# Altium schematic sheet FPGA PCIe.SchDoc: FPGA PCIe
size A4; Organization: Blinkinlabs, LLC; DocumentNumber: 10; SheetNumber: 11; SheetTotal: 14
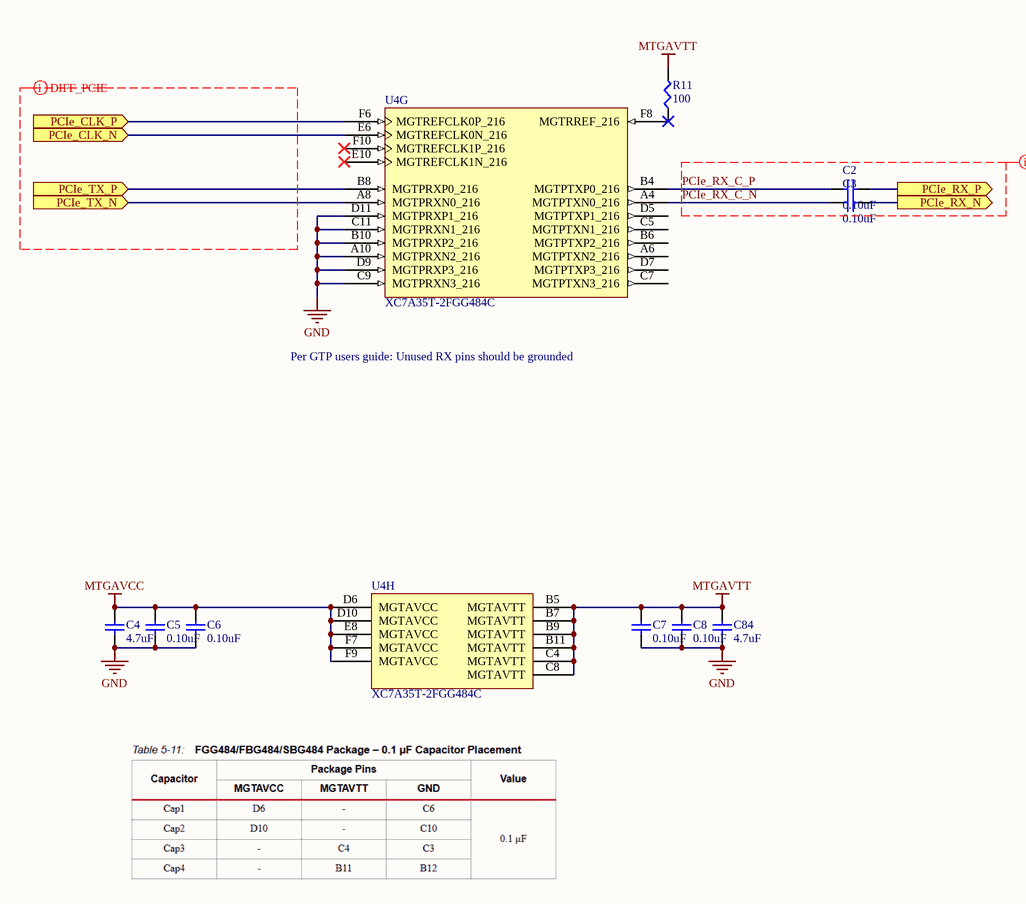
[diagram p0: FPGA PCIe.SchDoc]

## Parts
C2  0.10uF  [CAPC0603X03L]
C3  0.10uF  [CAPC0603X03L]
C4  4.7uF  [CAPC1005X06L]
C5  0.10uF  [CAPC0603X03L]
C6  0.10uF  [CAPC0603X03L]
C7  0.10uF  [CAPC0603X03L]
C8  0.10uF  [CAPC0603X03L]
C84  4.7uF  [CAPC1005X06L]
R11  100  [ERJ2G(0402)_L]
U4  XC7A35T-2FGG484C  [FGG484]  (parts G,H of 12)

## Ports
PCIe_CLK_N (in), PCIe_CLK_P (in), PCIe_RX_N (out), PCIe_RX_P (out), PCIe_TX_N (in), PCIe_TX_P (in)

## Nets
GND: C4.1 C5.2 C6.2 C7.2 C8.2 C84.1 U4.A10(MGTPRXN2_216) U4.B10(MGTPRXP2_216) U4.C9(MGTPRXN3_216) U4.C11(MGTPRXN1_216) U4.D9(MGTPRXP3_216) U4.D11(MGTPRXP1_216)
MTGAVCC: C4.2 C5.1 C6.1 U4.D6(MGTAVCC) U4.D10(MGTAVCC) U4.E8(MGTAVCC) U4.F7(MGTAVCC) U4.F9(MGTAVCC)
MTGAVTT: C7.1 C8.1 C84.2 R11.2 U4.B5(MGTAVTT) U4.B7(MGTAVTT) U4.B9(MGTAVTT) U4.B11(MGTAVTT) U4.C4(MGTAVTT) U4.C8(MGTAVTT)
PCIe_CLK_N: U4.E6(MGTREFCLK0N_216) ; port PCIe_CLK_N
PCIe_CLK_P: U4.F6(MGTREFCLK0P_216) ; port PCIe_CLK_P
PCIe_RX_C_N: C3.1 U4.A4(MGTPTXN0_216)
PCIe_RX_C_P: C2.1 U4.B4(MGTPTXP0_216)
PCIe_RX_N: C3.2 ; port PCIe_RX_N
PCIe_RX_P: C2.2 ; port PCIe_RX_P
PCIe_TX_N: U4.A8(MGTPRXN0_216) ; port PCIe_TX_N
PCIe_TX_P: U4.B8(MGTPRXP0_216) ; port PCIe_TX_P
NetR11_1: R11.1 U4.F8(MGTRREF_216)

Not connected (* = marked no-connect by the designer): U4 A6(MGTPTXN2_216) B6(MGTPTXP2_216) C5(MGTPTXN1_216) C7(MGTPTXN3_216) D5(MGTPTXP1_216) D7(MGTPTXP3_216) E10(MGTREFCLK1N_216)* F10(MGTREFCLK1P_216)*

## Layout directives
differential pair; differential pair class DIFF_90Ohm_PCIE; differential pair class DIFF_PCIE; net class PCIE; rule Matched Net Lengths [Tolerance = 0.1mm]: (no net found under the mark), PCIe_RX_C_N, PCIe_RX_C_P

## Notes on the sheet
- Per GTP users guide: Unused RX pins should be grounded
- Title:
- Project:
- Revision:
- Date:
- Time:
- Sheet
- of

## Library data of the parts
C2 C3 C5-C8 = GRM033R60J104KE19J: CAP CER 0.1UF 6.3V X5R 0201; Manufacturer: Murata Electronics North America; Tolerance: ±10%; Datasheets: http://www.murata.com/~/media/webrenewal/support/library/catalog/products/capacitor/mlcc/c02e.pdf; Image: //media.digikey.com/Renders/Murata%20Renders/ZRB-SERIES-0402.jpg; Digi-Key Part Number: 490-8155-1-ND; Packaging: Cut Tape (CT); Series: GRM; Value: 0.10uF; Voltage: 6.3V; Temperature Coefficient: X5R; Operating Temperature: -55°C ~ 85°C; Features: -; Applications: General Purpose; Mounting Type: 0201 (0603 Metric); Package / Case: 0.024" L x 0.012" W (0.60mm x 0.30mm); Case/Package: 0201
C4 C84 = GRM155R60G475ME47D: CAP CER 4.7UF 4V X5R 0402; Manufacturer: Murata Electronics North America; Tolerance: ±20%; PartNumber: GRM155R60G475ME47D; Datasheets: http://www.murata.com/~/media/webrenewal/support/library/catalog/products/capacitor/mlcc/c02e.pdf; Image: //media.digikey.com/Renders/Murata%20Renders/ZRB-SERIES-0402.jpg; Digi-Key Part Number: 490-11980-1-ND; Packaging: Cut Tape (CT); Series: GRM; Value: 4.7uF; Voltage: 4V; Temperature Coefficient: X5R; Operating Temperature: -55°C ~ 85°C; Features: -; Applications: General Purpose; Package / Case: 0402 (1005 Metric); Case/Package: 0402
R11 = ERJ-2RKF1000X: RES SMD 100 OHM 1% 1/10W 0402; Manufacturer: Panasonic Electronic Components; Power (Watts): 0.1W, 1/10W; Temperature Coefficient: ±100ppm/°C; PartNumber: ERJ-2RKF1000X; Datasheets: http://industrial.panasonic.com/www-cgi/jvcr13pz.cgi?E+PZ+3+AOA0002+ERJ2RKF1000X+7+WW; Image: //media.digikey.com/Photos/Panasonic%20Photos/ERJ-PA2-Series.jpg; Digi-Key Part Number: P100LCT-ND; Series: ERJ; Value: 100; Tolerance: ±1%; Composition: Thick Film; Features: Automotive AEC-Q200; Operating Temperature: -55°C ~ 155°C; Package / Case: 0402 (1005 Metric); Case/Package: 0402; Size / Dimension: 0.039" L x 0.020" W (1.00mm x 0.50mm); Height - Seated (Max): 0.016" (0.40mm); Number of Terminations: 2
U4 = CMP-0383-00019-1: Artix-7 FPGA, 250 User I/Os, 4 GTP, 484-Ball BGA, Speed Grade 2, Commercial Grade, Pb-Free; Manufacturer: Xilinx; Total Block RAM: 1800 Kb; GTP: 4; Available User I/O: 250; Speed Grades: 2; Logic Cells: 33280; CMTs: 5; ComponentLink3URL: http://www.xilinx.com/support/documentation/user_guides/ug475_7Series_Pkg_Pinout.pdf; PackageVersion: Rev. 1.11; ComponentLink2Description: Datasheet; ComponentLink3Description: Pinout; PartNumber: XC7A35T-2FGG484C; DatasheetVersion: Rev. 1.15; Operating Temperature Range: Commercial; PackageDescription: 484-Ball Wire-Bond Fine-Pitch BGA, Body 23 x 23 mm, Pitch 1 mm; ComponentLink4Description: Package Specification; Maximum Distributed RAM: 400 Kb; Mounting Technology: Surface Mount; ComponentLink2URL: http://www.xilinx.com/support/documentation/data_sheets/ds180_7Series_Overview.pdf; ComponentLink1Description: Manufacturer URL; ComponentLink4URL: http://www.xilinx.com/support/documentation/user_guides/ug475_7Series_Pkg_Pinout.pdf; PackageReference: FGG484; ComponentLink1URL: http://www.xilinx.com/